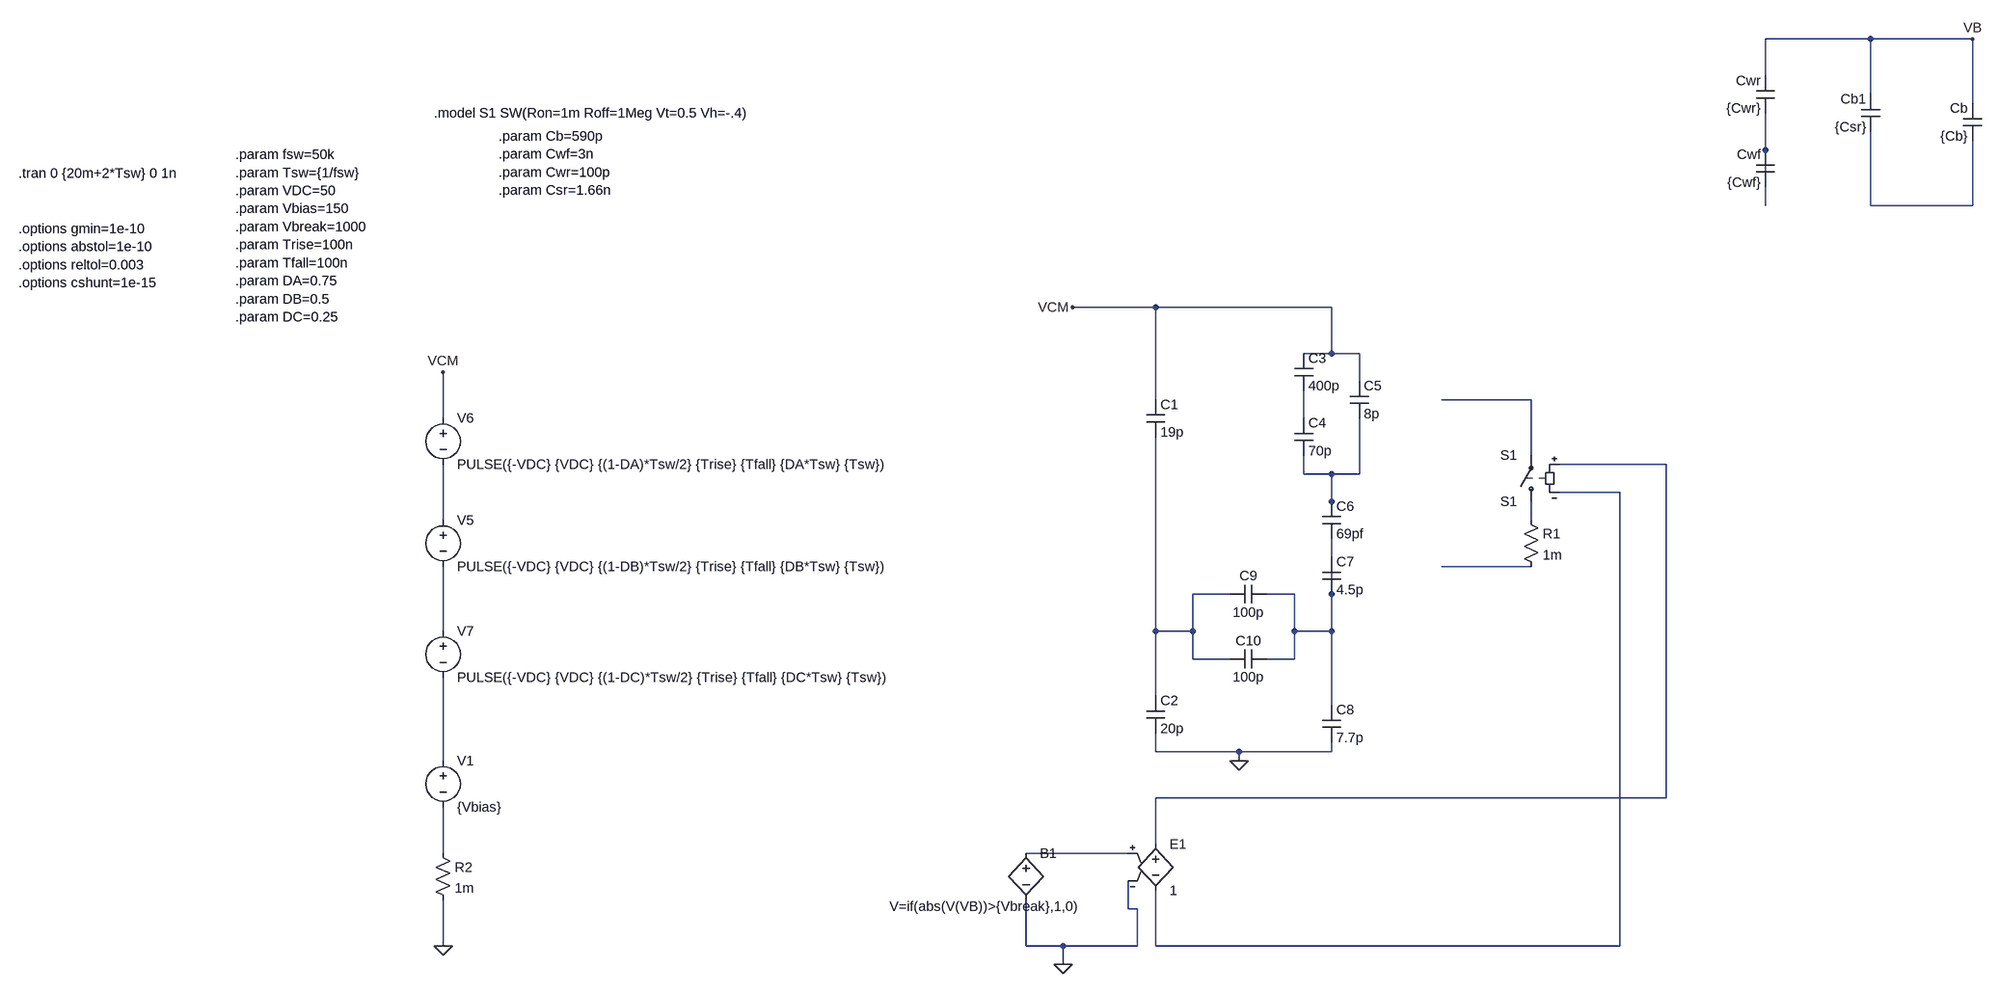
[diagram p0: schematic BearingCurrentModel-Single - Copy.asc]
BearingCurrentModel-Single - Copy.asc, the LTspice schematic file:
Version 4
SHEET 1 4356 2932
WIRE 1792 -96 1600 -96
WIRE 1968 -96 1792 -96
WIRE 1600 -32 1600 -96
WIRE 1792 0 1792 -96
WIRE 1968 16 1968 -96
WIRE 1600 96 1600 32
WIRE 1600 144 1600 96
WIRE 1600 192 1600 160
WIRE 1792 192 1792 64
WIRE 1968 192 1968 80
WIRE 1968 192 1792 192
WIRE 176 368 32 368
WIRE 480 368 176 368
WIRE 480 448 480 368
WIRE 480 448 432 448
WIRE 528 448 480 448
WIRE 528 496 528 448
WIRE 176 528 176 368
WIRE 880 528 672 528
WIRE -1056 560 -1056 480
WIRE 432 560 432 512
WIRE 880 624 880 528
WIRE 1152 640 928 640
WIRE 432 656 432 624
WIRE 480 656 432 656
WIRE 528 656 528 560
WIRE 528 656 480 656
WIRE 1072 688 928 688
WIRE 480 704 480 656
WIRE 480 720 480 704
WIRE -1056 736 -1056 640
WIRE 880 736 880 704
WIRE 480 800 480 768
WIRE 880 816 672 816
WIRE 304 864 240 864
WIRE 416 864 368 864
WIRE 480 864 480 816
WIRE -1056 928 -1056 816
WIRE 176 928 176 592
WIRE 240 928 240 864
WIRE 240 928 176 928
WIRE 416 928 416 864
WIRE 480 928 480 864
WIRE 480 928 416 928
WIRE 240 976 240 928
WIRE 304 976 240 976
WIRE 416 976 416 928
WIRE 416 976 368 976
WIRE 176 1040 176 928
WIRE 480 1056 480 928
WIRE 176 1136 176 1104
WIRE 320 1136 176 1136
WIRE 480 1136 480 1120
WIRE 480 1136 320 1136
WIRE -1056 1152 -1056 1008
WIRE 320 1152 320 1136
WIRE 1152 1216 1152 640
WIRE 1152 1216 176 1216
WIRE 176 1296 176 1216
WIRE -1056 1312 -1056 1232
WIRE 128 1312 -48 1312
WIRE 128 1408 128 1360
WIRE 144 1408 128 1408
WIRE -1056 1472 -1056 1392
WIRE -48 1472 -48 1392
WIRE 16 1472 -48 1472
WIRE 144 1472 144 1408
WIRE 144 1472 16 1472
WIRE 176 1472 176 1376
WIRE 1072 1472 1072 688
WIRE 1072 1472 176 1472
WIRE 16 1504 16 1472
FLAG -1056 480 VCM
FLAG 32 368 VCM
FLAG 16 1504 0
FLAG 1968 -96 VB
FLAG -1056 1472 0
FLAG 320 1152 0
SYMBOL cap 1616 32 R180
WINDOW 0 24 56 Left 2
WINDOW 3 24 8 Left 2
SYMATTR InstName Cwr
SYMATTR Value {Cwr}
SYMBOL cap 1616 160 R180
WINDOW 0 24 56 Left 2
WINDOW 3 24 8 Left 2
SYMATTR InstName Cwf
SYMATTR Value {Cwf}
SYMBOL cap 1984 80 R180
WINDOW 0 24 56 Left 2
WINDOW 3 24 8 Left 2
SYMATTR InstName Cb
SYMATTR Value {Cb}
SYMBOL voltage -1056 720 R0
WINDOW 123 0 0 Left 0
WINDOW 39 0 0 Left 0
SYMATTR InstName V5
SYMATTR Value PULSE({-VDC} {VDC} {(1-DB)*Tsw/2} {Trise} {Tfall} {DB*Tsw} {Tsw})
SYMBOL voltage -1056 544 R0
WINDOW 123 0 0 Left 0
WINDOW 39 0 0 Left 0
SYMATTR InstName V6
SYMATTR Value PULSE({-VDC} {VDC} {(1-DA)*Tsw/2} {Trise} {Tfall} {DA*Tsw} {Tsw})
SYMBOL voltage -1056 912 R0
WINDOW 123 0 0 Left 0
WINDOW 39 0 0 Left 0
SYMATTR InstName V7
SYMATTR Value PULSE({-VDC} {VDC} {(1-DC)*Tsw/2} {Trise} {Tfall} {DC*Tsw} {Tsw})
SYMBOL cap 1808 64 R180
WINDOW 0 24 56 Left 2
WINDOW 3 24 8 Left 2
SYMATTR InstName Cb1
SYMATTR Value {Csr}
SYMBOL e 176 1280 R0
SYMATTR InstName E1
SYMATTR Value 1
SYMBOL bv -48 1296 R0
WINDOW 3 -236 108 Left 2
SYMATTR Value V=if(abs(V(VB))>{Vbreak},1,0)
SYMATTR InstName B1
SYMBOL sw 880 720 R180
SYMATTR InstName S1
SYMATTR Value S1
SYMBOL res 864 720 R0
SYMATTR InstName R1
SYMATTR Value 1m
SYMBOL voltage -1056 1136 R0
WINDOW 123 0 0 Left 0
WINDOW 39 0 0 Left 0
SYMATTR InstName V1
SYMATTR Value {Vbias}
SYMBOL res -1072 1296 R0
SYMATTR InstName R2
SYMATTR Value 1m
SYMBOL cap 160 528 R0
SYMATTR InstName C1
SYMATTR Value 19p
SYMBOL cap 160 1040 R0
SYMATTR InstName C2
SYMATTR Value 20p
SYMBOL cap 416 448 R0
SYMATTR InstName C3
SYMATTR Value 400p
SYMBOL cap 416 560 R0
SYMATTR InstName C4
SYMATTR Value 70p
SYMBOL cap 512 496 R0
SYMATTR InstName C5
SYMATTR Value 8p
SYMBOL cap 464 704 R0
SYMATTR InstName C6
SYMATTR Value 69pf
SYMBOL cap 464 800 R0
SYMATTR InstName C7
SYMATTR Value 4.5p
SYMBOL cap 464 1056 R0
SYMATTR InstName C8
SYMATTR Value 7.7p
SYMBOL cap 368 848 R90
WINDOW 0 0 32 VBottom 2
WINDOW 3 32 32 VTop 2
SYMATTR InstName C9
SYMATTR Value 100p
SYMBOL cap 368 960 R90
WINDOW 0 0 32 VBottom 2
WINDOW 3 32 32 VTop 2
SYMATTR InstName C10
SYMATTR Value 100p
TEXT -960 72 Left 2 !.param Cb=590p\n.param Cwf=3n\n.param Cwr=100p\n.param Csr=1.66n
TEXT -2120 136 Left 2 !.tran 0 {20m+2*Tsw} 0 1n
TEXT -2120 232 Left 2 !.options gmin=1e-10   \n.options abstol=1e-10  \n.options reltol=0.003  \n.options cshunt=1e-15
TEXT -1520 104 Left 2 !.param fsw=50k\n.param Tsw={1/fsw}\n.param VDC=50\n.param Vbias=150\n.param Vbreak=1000\n.param Trise=100n\n.param Tfall=100n\n.param DA=0.75\n.param DB=0.5\n.param DC=0.25
TEXT -1072 32 Left 2 !.model S1 SW(Ron=1m Roff=1Meg Vt=0.5 Vh=-.4)

The netlist it stands for:
* BearingCurrentModel-Single - Copy.asc
Cwr N001 VB {Cwr}
Cwf N002 N001 {Cwf}
Cb N003 VB {Cb}
V5 N009 N015 PULSE({-VDC} {VDC} {(1-DB)*Tsw/2} {Trise} {Tfall} {DB*Tsw} {Tsw})
V6 VCM N009 PULSE({-VDC} {VDC} {(1-DA)*Tsw/2} {Trise} {Tfall} {DA*Tsw} {Tsw})
V7 N015 N016 PULSE({-VDC} {VDC} {(1-DC)*Tsw/2} {Trise} {Tfall} {DC*Tsw} {Tsw})
Cb1 N003 VB {Csr}
E1 N006 N008 N018 0 1
B1 N018 0 V=if(abs(V(VB))>{Vbreak},1,0)
S1 N010 N004 N006 N008 S1
R1 N010 N012 1m
V1 N016 N017 {Vbias}
R2 N017 0 1m
C1 VCM N013 19p
C2 N013 0 20p
C3 VCM N005 400p
C4 N005 N007 70p
C5 VCM N007 8p
C6 N007 N011 69pf
C7 N011 N014 4.5p
C8 N014 0 7.7p
C9 N014 N013 100p
C10 N014 N013 100p
.param Cb=590p
.param Cwf=3n
.param Cwr=100p
.param Csr=1.66n
.tran 0 {20m+2*Tsw} 0 1n
.options gmin=1e-10
.options abstol=1e-10
.options reltol=0.003
.options cshunt=1e-15
.param fsw=50k
.param Tsw={1/fsw}
.param VDC=50
.param Vbias=150
.param Vbreak=1000
.param Trise=100n
.param Tfall=100n
.param DA=0.75
.param DB=0.5
.param DC=0.25
.model S1 SW(Ron=1m Roff=1Meg Vt=0.5 Vh=-.4)
.backanno
.end